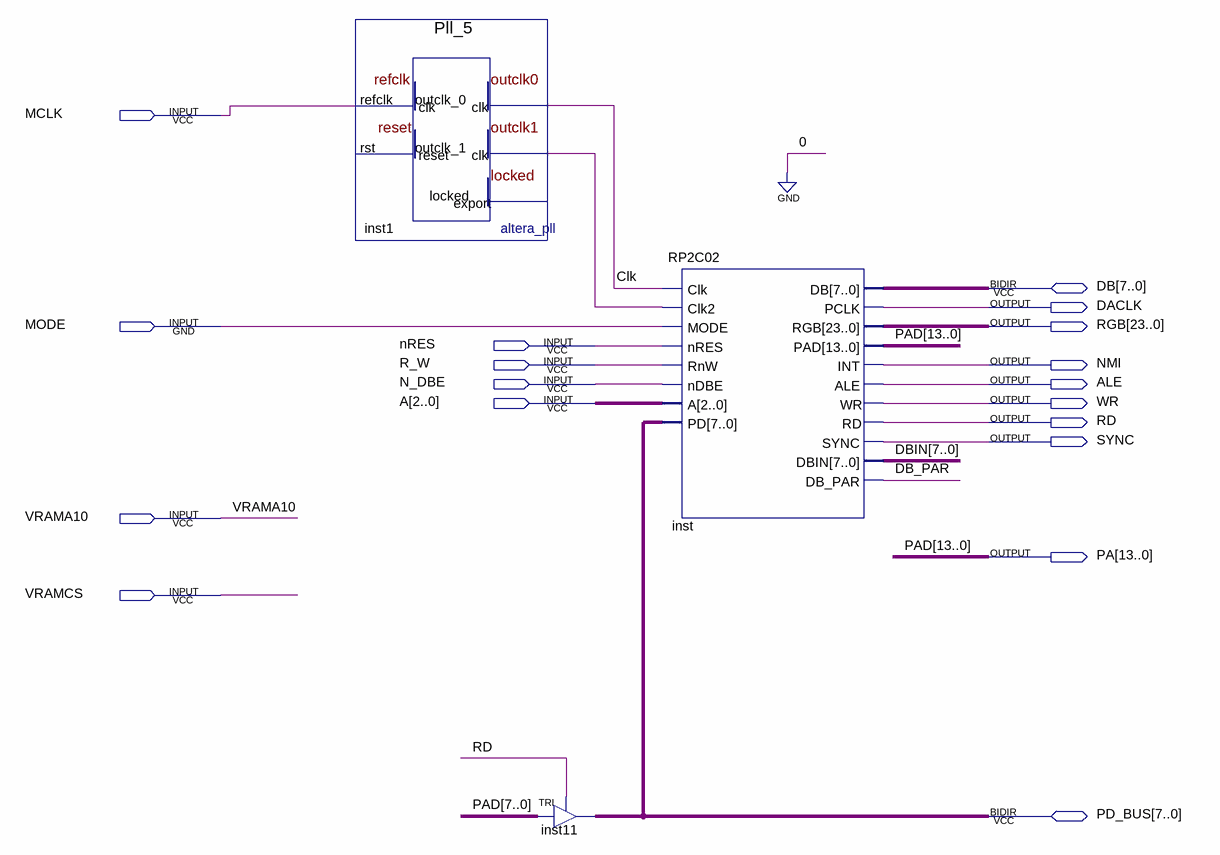
[diagram p0: schematic sheet]
// Quartus schematic V2.bdf as structural Verilog: 3 symbols, 18 pins
module V2 (
  input  MCLK,
  input  MODE,
  input  nRES,
  input  R_W,
  input  N_DBE,
  input  [2:0] A,
  input  VRAMA10,
  input  VRAMCS,
  inout  [7:0] DB,
  inout  [7:0] PD_BUS,
  output DACLK,
  output [23:0] RGB,
  output NMI,
  output ALE,
  output WR,
  output RD,
  output SYNC,
  output [13:0] PA
);

  wire Clk, DB_PAR, inst1_outclk_1;
  wire [7:0] DBIN;

  Pll_5 inst1 (.refclk(MCLK), .outclk_0(Clk), .outclk_1(inst1_outclk_1));  // open: rst, locked
  TRI inst11[7:0] (.IN(PA[7:0]), .OE(RD), .OUT(PD_BUS));
  RP2C02 inst (
    .Clk(Clk), .Clk2(inst1_outclk_1), .MODE(MODE), .nRES(nRES), .RnW(R_W), .nDBE(N_DBE), .A(A), .PD(PD_BUS),
    .PCLK(DACLK), .RGB(RGB), .PAD(PA), .INT(NMI), .ALE(ALE), .WR(WR), .RD(RD), .SYNC(SYNC), .DBIN(DBIN),
    .DB_PAR(DB_PAR), .DB(DB));

  // Other names for the same wires on the sheet: PAD[13:0] = PA
endmodule
